# Altium schematic sheet imu.SchDoc
size A4; Scale: 1:1; DocumentType: Схема электрическая принципиальная; FirstReferrence: АБВГ.123456.001
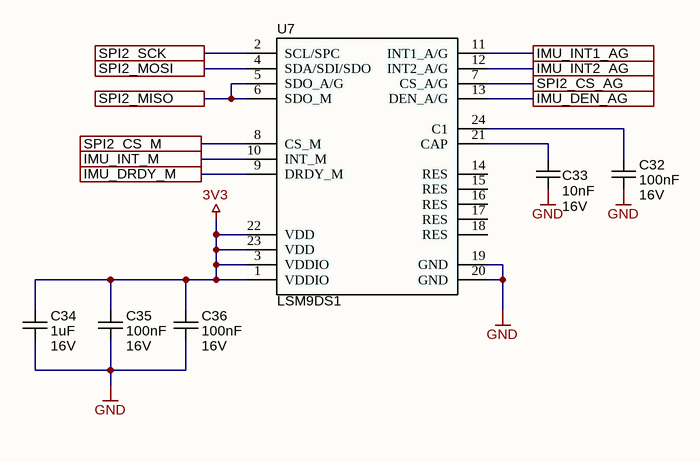
[diagram p0: imu.SchDoc]

## Parts
C32  value 100nF  Voltage: 16V  [C0603]  (hidden comment: C0603)
C33  value 10nF  Voltage: 16V  [C0603]  (hidden comment: C0603)
C34  value 1uF  Voltage: 16V  [C0603]  (hidden comment: C0603)
C35  value 100nF  Voltage: 16V  [C0603]  (hidden comment: C0603)
C36  value 100nF  Voltage: 16V  [C0603]  (hidden comment: C0603)
U7  LSM9DS1  [STM-LGA-24_3500X3000X1000]

## Ports
IMU_DEN_AG, IMU_DRDY_M, IMU_INT1_AG, IMU_INT2_AG, IMU_INT_M, SPI2_CS_AG, SPI2_CS_M, SPI2_MISO, SPI2_MOSI, SPI2_SCK

## Nets
3V3: C34.1 C35.1 C36.1 U7.1(VDDIO) U7.3(VDDIO) U7.22(VDD) U7.23(VDD)
GND: C32.2 C33.1 C34.2 C35.2 C36.2 U7.19(GND) U7.20(GND)
IMU_DEN_AG: U7.13(DEN_A/G) ; port IMU_DEN_AG
IMU_DRDY_M: U7.9(DRDY_M) ; port IMU_DRDY_M
IMU_INT1_AG: U7.11(INT1_A/G) ; port IMU_INT1_AG
IMU_INT2_AG: U7.12(INT2_A/G) ; port IMU_INT2_AG
IMU_INT_M: U7.10(INT_M) ; port IMU_INT_M
SPI2_CS_AG: U7.7(CS_A/G) ; port SPI2_CS_AG
SPI2_CS_M: U7.8(CS_M) ; port SPI2_CS_M
SPI2_MISO: U7.5(SDO_A/G) U7.6(SDO_M) ; port SPI2_MISO
SPI2_MOSI: U7.4(SDA/SDI/SDO) ; port SPI2_MOSI
SPI2_SCK: U7.2(SCL/SPC) ; port SPI2_SCK
NetC32_1: C32.1 U7.24(C1)
NetC33_2: C33.2 U7.21(CAP)

Not connected (* = marked no-connect by the designer): U7 14(RES) 15(RES) 16(RES) 17(RES) 18(RES)

## Notes on the sheet
- Title
- Size:
- Date:
- A4
- Number:
- Time:
- Revision:
- Sheet
- of
- File:

## Library data of the parts
U7 = STM-LSM9DS1-24
C32-C36 = C0603: Model: *